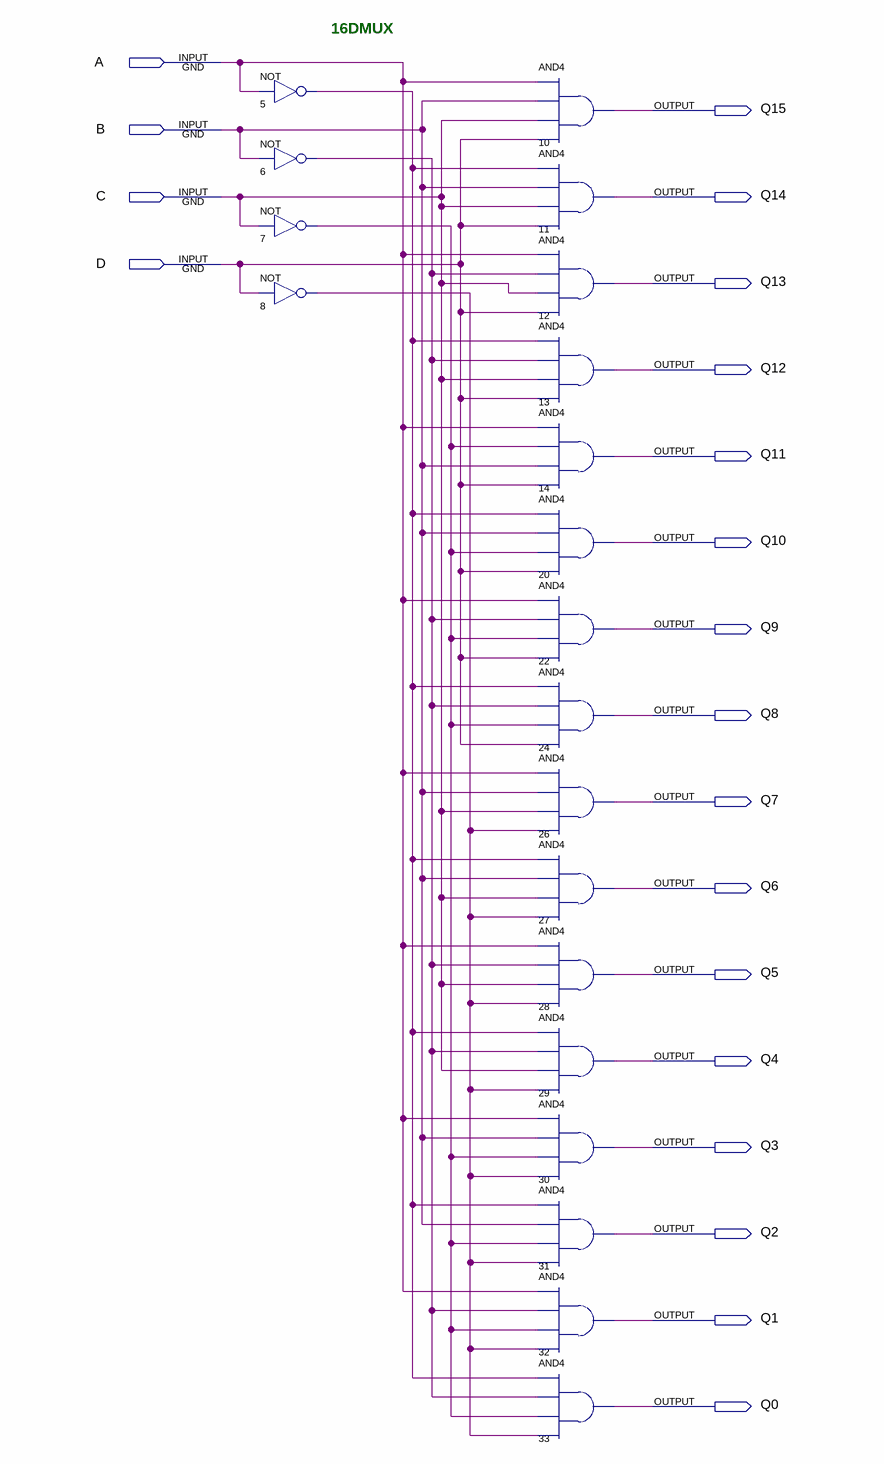
[diagram p0: schematic sheet]
// Quartus schematic 16dmux.bdf as structural Verilog: 20 symbols, 20 pins
module \16dmux  (
  input  A,
  input  B,
  input  C,
  input  D,
  output Q15,
  output Q14,
  output Q13,
  output Q12,
  output Q11,
  output Q10,
  output Q9,
  output Q8,
  output Q7,
  output Q6,
  output Q5,
  output Q4,
  output Q3,
  output Q2,
  output Q1,
  output Q0
);

  wire n5_out, n6_out, n7_out, n8_out;

  not u_5 (n5_out, A);
  not u_6 (n6_out, B);
  not u_7 (n7_out, C);
  not u_8 (n8_out, D);
  and u_10 (Q15, A, B, C, D);
  and u_11 (Q14, n5_out, B, C, D);
  and u_12 (Q13, A, n6_out, C, D);
  and u_13 (Q12, n5_out, n6_out, C, D);
  and u_14 (Q11, A, n7_out, B, D);
  and u_20 (Q10, n5_out, B, n7_out, D);
  and u_22 (Q9, A, n6_out, n7_out, D);
  and u_24 (Q8, n5_out, n6_out, n7_out, D);
  and u_26 (Q7, A, B, C, n8_out);
  and u_27 (Q6, n5_out, B, C, n8_out);
  and u_28 (Q5, A, n6_out, C, n8_out);
  and u_29 (Q4, n5_out, n6_out, C, n8_out);
  and u_30 (Q3, A, B, n7_out, n8_out);
  and u_31 (Q2, n5_out, B, n7_out, n8_out);
  and u_32 (Q1, A, n6_out, n7_out, n8_out);
  and u_33 (Q0, n5_out, n6_out, n7_out, n8_out);

  // Notes on the sheet:
  //   16DMUX
endmodule
